# Altium schematic sheet Diode - TVS.SchDoc
size A3; SheetNumber: 25; SheetTotal: 40
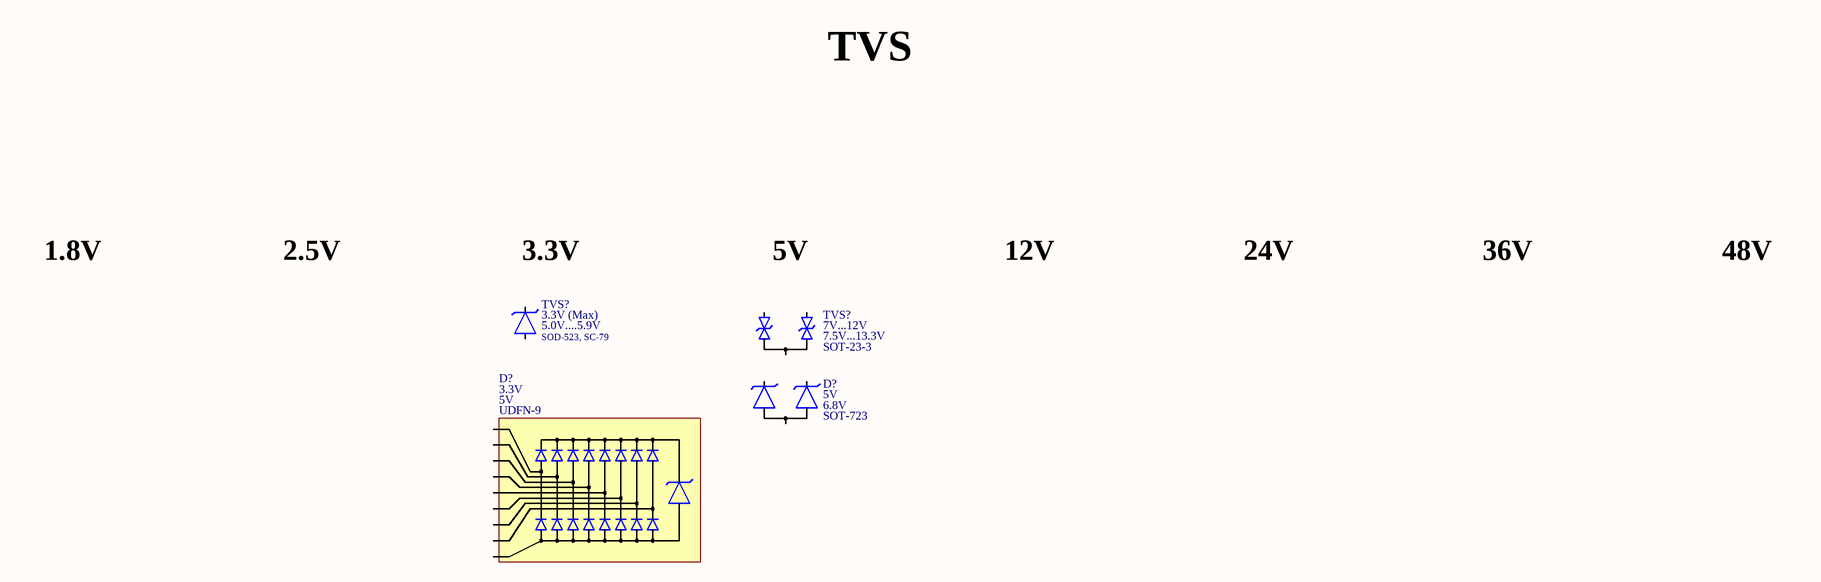
[diagram p0: Diode - TVS.SchDoc]

## Parts
(Parts that share a designator on the sheet are numbered #1, #2 ... from top to bottom, then left to right.)
D?#1  Voltage, Break Down: 5V  Voltage, Stand Off: 3.3V  Package: UDFN-9  [Diode_Tvs_9P_Common_Anode - Diodes, DT1240A-08LP3810-7]  (hidden comment: Diode_Tvs_9P_Common_Anode - Diodes, DT1240A-08LP3810-7)
D?#2  Voltage, Break Down: 6.8V  Voltage, Stand Off: 5V  Package: SOT-723  [Diode_SOT-723_2P_Common_Anode_Type_1]  (hidden comment: Diode_Tvs_2P_Common_Anode)
TVS?#1  Voltage, Break Down: 5.0V....5.9V  Voltage, Stand Off: 3.3V (Max)  Package: SOD-523, SC-79  [Diode_SOD-523_SC-79]  (hidden comment: Diode_Tvs)
TVS?#2  Voltage, Break Down: 7.5V...13.3V  Voltage, Stand Off: 7V...12V  Package: SOT-23-3  [Diode_SOT-23-3_2P_Bidirectional_Type_1]  (hidden comment: Diode_Tvs_2P_Bidirectional)

## Nets

Not connected (* = marked no-connect by the designer): D?#1 1 2 3 4 5 6 7 8 9; D?#2 A C1 C2; TVS?#1 A C; TVS?#2 Common D1 D2

## Notes on the sheet
- TVS
- 1.8V
- 2.5V
- (near TVS?#1) 3.3V
- (near TVS?#2) 5V
- 12V
- 24V
- 36V
- 48V

## Library data of the parts
D?#1 = Diode_Tvs_9P_Common_Anode - Diodes, DT1240A-08LP3810-7: Component Category: Diode; ComponentLink1Description: Datasheet; ComponentLink1URL: E:\Altium\Datasheets\Diode\Diodes, DT1240A-08LP3810-7.pdf; ComponentLink2Description: Supplier Link; ComponentLink2URL: https://www.digikey.com/en/products/detail/diodes-incorporated/dt1240a-08lp3810-7/8255867; Manufacturer Part Number: DT1240A-08LP3810-7; Supplier: Digikey; Supplier Part Number: DT1240A-08LP3810-7DICT-ND; Manufacturer: Diodes; Operating Temperature, Min: -55℃; Operating Temperature, Max: +86℃; Quantity, Min: 1; Quantity, Max: 2500; Price, Min: 0.10245; Price, Max: 0.42; Supplier Currency: $; Supplier Link: https://www.digikey.com/en/products/detail/diodes-incorporated/dt1240a-08lp3810-7/8255867; Component Type: TVS
D?#2 = Diode_Tvs_2P_Common_Anode: Diode, TVS, 5V/6.8V, SOD-723; Manufacturer Part Number: DF3A6.8LFV,L3F; Manufacturer: Toshiba; ComponentLink1Description: Datasheet; ComponentLink1URL: E:\Altium\Datasheets\Diode\Toshiba, DF3A6.8LFV.pdf; ComponentLink2Description: Supplier Link; ComponentLink2URL: https://www.digikey.com/en/products/detail/toshiba-semiconductor-and-storage/DF3A6-8LFV-L3F/4305070; Supplier: Digikey; Supplier Part Number: DF3A6.8LFVL3FCT-ND; Operating Temperature, Min: ---℃; Operating Temperature, Max: ---℃; Quantity, Min: 1; Quantity, Max: 200000; Price, Min: 0.25; Price, Max: 0.027; Supplier Currency: $; Supplier Link: https://www.digikey.com/en/products/detail/toshiba-semiconductor-and-storage/DF3A6-8LFV-L3F/4305070; Component Type: Tvs; Component Category: Diode
TVS?#1 = Diode_Tvs: Manufacturer Part Number: CESD3V3D5; Manufacturer: SMC; Component Category: Diode; ComponentLink1Description: Datasheet; ComponentLink1URL: E:\Altium\Datasheets\Diode\SMC, CESDxxxD5.pdf; ComponentLink2Description: Supplier Link; ComponentLink2URL: https://www.digikey.com/en/products/detail/smc-diode-solutions/CESD3V3D5/16584901; Supplier: Digikey; Supplier Part Number: 1655-CESD3V3D5CT-ND; Operating Temperature, Min: -55℃; Operating Temperature, Max: +150℃; Quantity, Min: 1; Quantity, Max: 8000; Price, Min: 0.1; Price, Max: 0.02386; Supplier Currency: $; Supplier Link: https://www.digikey.com/en/products/detail/smc-diode-solutions/CESD3V3D5/16584901; Component Type: Zener
TVS?#2 = Diode_Tvs_2P_Bidirectional: TVS, 2P, Bidirectional, 7V/12V, SOT-23-3; Manufacturer Part Number: CDSOT23-SM712; Manufacturer: Bourns; Component Category: Diode; ComponentLink1Description: Datasheet; ComponentLink1URL: E:\Altium\Datasheets\Diode\Bourns, CDSOT23-SM712.pdf; ComponentLink2Description: Supplier Link; ComponentLink2URL: https://www.digikey.com/en/products/detail/bourns-inc/CDSOT23-SM712/1630592; Supplier: Digikey; Supplier Part Number: CDSOT23-SM712CT-ND; Operating Temperature, Min: -55℃; Operating Temperature, Max: +150℃; Quantity, Min: 1; Quantity, Max: 3000; Price, Min: 1.59; Price, Max: 0.675; Supplier Currency: $; Supplier Link: https://www.digikey.com/en/products/detail/bourns-inc/CDSOT23-SM712/1630592; Component Type: TVS